# EAGLE design pomppurobotti (EAGLE 7.1.0)
dsdsdsds sddsdsdsds sddsds
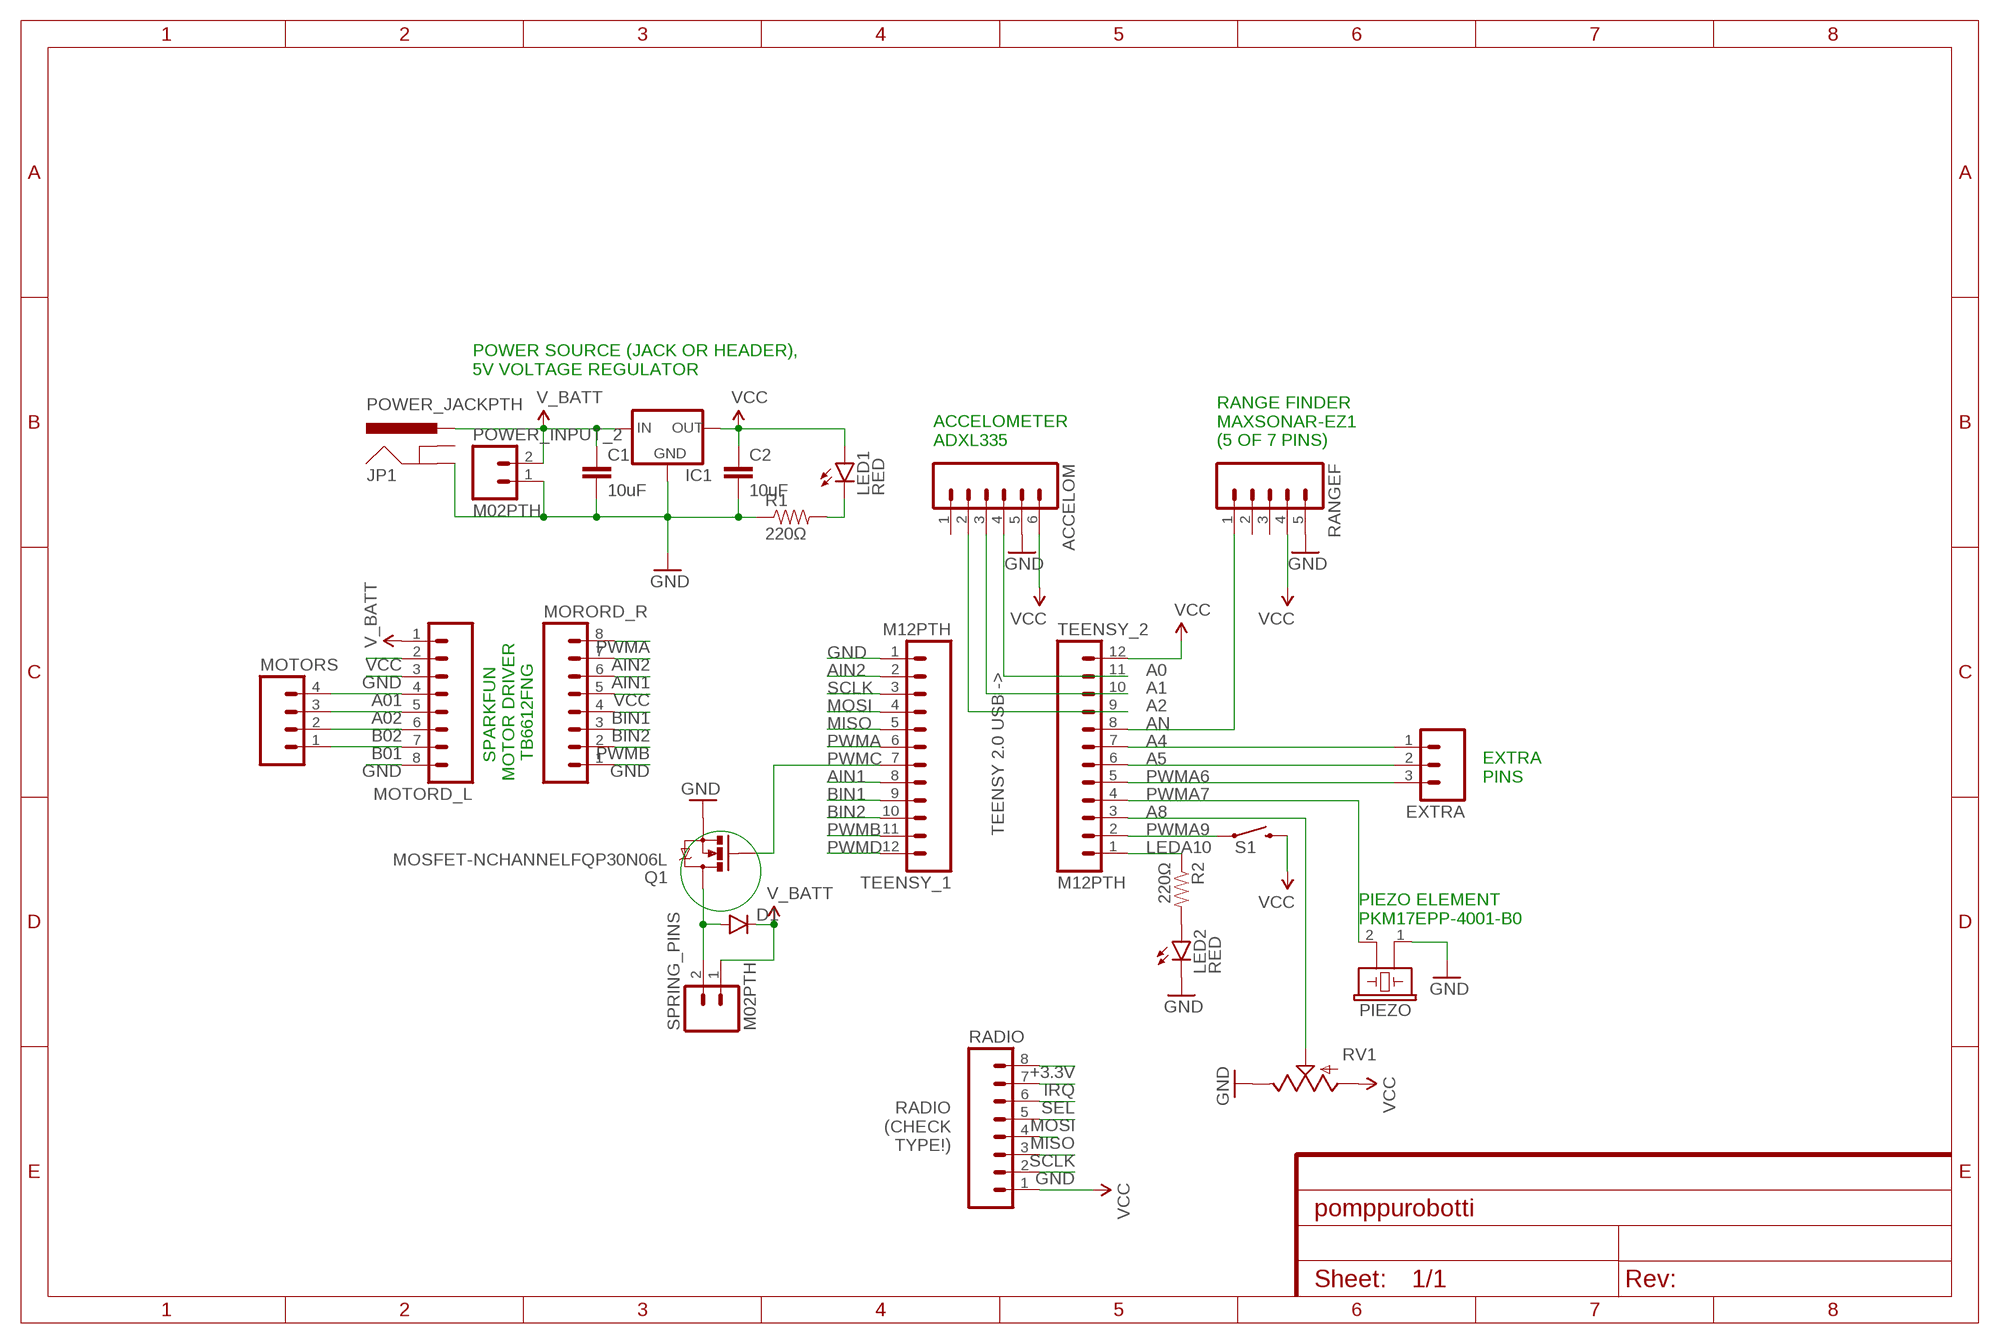
[diagram p0: schematic, sheet 1]
FRAME1 (FRAME-A4L): CNAME: Sähköpaja, pomppurobotin PCB; CREVISION: 23.11.14; DESIGNER: Atte Keinänen

## Parts
ACCELOM  M06SILK_FEMALE_PTH  [1X06]
C1  10uF  CAPPTH  [CAP-PTH-SMALL]
C2  10uF  CAPPTH  [CAP-PTH-SMALL]
D1  DIODEPTH  [DIODE-1N4001]
EXTRA  M03PTH  [1X03]
IC1  V_REG_78XX-TO-220  [TO-220-ALT]
JP1  POWER_JACKPTH  [POWER_JACK_PTH]
LED1  RED  LED5MM  [LED5MM]
LED2  RED  LED5MM  [LED5MM]
MORORD_R  M08LONGPADS  [1X08_LONGPADS]
MOTORD_L  M08LONGPADS  [1X08_LONGPADS]
MOTORS  M04PTH  [1X04]
PIEZO  EFBAA40D101  [EFBAA40D101]
POWER_INPUT_2  M02PTH  [1X02]
Q1  MOSFET-NCHANNELFQP30N06L  [TO220V]
R1  220Ω  RESISTORAXIAL-0.3  [AXIAL-0.3]
R2  220Ω  RESISTORAXIAL-0.3  [AXIAL-0.3]
RADIO  M08  [1X08_ROUND]
RANGEF  M05PTH  [1X05]
RV1  POTTRIM  [TRIM_POT]
S1  SWITCH-MOMENTARY-2PTH  [TACTILE-PTH]
SPRING_PINS  M02PTH  [1X02]
TEENSY_1  M12PTH  [1X12]
TEENSY_2  M12PTH  [1X12]

## Nets
+3.3V: RADIO.8
A0: ACCELOM.2 TEENSY_2.9
A1: ACCELOM.3 TEENSY_2.10
A01: MOTORD_L.4 MOTORS.4
A2: ACCELOM.4 TEENSY_2.11
A02: MOTORD_L.5 MOTORS.3
A4: EXTRA.1 TEENSY_2.7
A5: EXTRA.2 TEENSY_2.6
A8: RV1.1(S) TEENSY_2.3
AIN1: MORORD_R.6 TEENSY_1.8
AIN2: MORORD_R.7 TEENSY_1.2
AN: RANGEF.1 TEENSY_2.8
B01: MOTORD_L.7 MOTORS.1
B02: MOTORD_L.6 MOTORS.2
BIN1: MORORD_R.4 TEENSY_1.9
BIN2: MORORD_R.3 TEENSY_1.10
GND: ACCELOM.5 C1.2 C2.2 IC1.GND JP1.GND LED2.K(C) MORORD_R.1 MOTORD_L.3 MOTORD_L.8 PIEZO.1 POWER_INPUT_2.1 Q1.3(S) R1.P$1 RADIO.2 RANGEF.5 RV1.2(E) TEENSY_1.1
IRQ: RADIO.7
LEDA10: R2.P$1 TEENSY_2.1
MISO: RADIO.4 TEENSY_1.5
MOSI: RADIO.5 TEENSY_1.4
N$2: LED1.K(C) R1.P$2
N$4: LED2.A R2.P$2
N$5: D1.A Q1.2(D) SPRING_PINS.2
PWMA: MORORD_R.8 TEENSY_1.6
PWMA6: EXTRA.3 TEENSY_2.5
PWMA7: PIEZO.2 TEENSY_2.4
PWMA9: S1.1 TEENSY_2.2
PWMB: MORORD_R.2 TEENSY_1.11
PWMC: Q1.1(G) TEENSY_1.7
PWMD: TEENSY_1.12
SCLK: RADIO.3 TEENSY_1.3
SEL: RADIO.6
V_BATT: C1.1 D1.C IC1.IN JP1.PWR MOTORD_L.1 POWER_INPUT_2.2 SPRING_PINS.1
VCC: ACCELOM.6 C2.1 IC1.OUT LED1.A MORORD_R.5 MOTORD_L.2 RADIO.1 RANGEF.4 RV1.3(A) S1.3 TEENSY_2.12
Unconnected: ACCELOM.1 JP1.GNDBREAK RANGEF.2 RANGEF.3

## Notes on the sheet
- POWER SOURCE (JACK OR HEADER),
  5V VOLTAGE REGULATOR
- ACCELOMETER
  ADXL335
- RANGE FINDER
  MAXSONAR-EZ1
  (5 OF 7 PINS)
- SPARKFUN 
  MOTOR DRIVER
  TB6612FNG
- EXTRA
  PINS
- TEENSY 2.0 USB ->
- PIEZO ELEMENT
  PKM17EPP-4001-B0
- RADIO
  (CHECK
  TYPE!)

## Library data of the parts
ACCELOM = SparkFun-Connectors:M06: Header 6 Standard 6-pin 0.1" header. Use with straight break away headers (SKU : PRT-00116), right angle break away headers (PRT-00553), swiss pins (PRT-00743), machine pins (PRT-00117), and female headers (PRT-00115). Molex polarized connector foot print use with SKU : PRT-08094 with associated crimp pins and housings. NOTES ON THE VARIANTS LOCK and LOCK_LONGPADS... This footprint was designed to help hold the alignment of a through-hole component (i.e. 6-pin header) while soldering it into place. You may notice that each hole has been shifted either up or down by 0.005 of an inch from it's more standard position (which is a perfectly straight line). This slight alteration caused the pins (the squares in the middle) to touch the edges of the holes. Because they are alternating, it causes a "brace" to hold the component in place. 0.005 has proven to be the perfect amount of "off-center" position when using our standard breakaway headers. Although looks a little odd when you look at the bare footprint, once you have a header in there, the alteration is very hard to notice. Also,if you push a header all the way into place, it is covered up entirely on the bottom side. This idea of altering the position of holes to aid alignment will be further integrated into the Sparkfun Library for other footprints. It can help hold any component with 3 or more connection pins.; PROD_ID: CONN-08437
C1 C2 = SparkFun-Capacitors:CAP: Capacitor Standard 0603 ceramic capacitor, and 0.1" leaded capacitor.
D1 = SparkFun-DiscreteSemi:DIODE: Diode These are standard reverse protection diodes and small signal diodes. SMA package can handle up to about 1A. SOD-323 can handle about 200mA. What the SOD-323 package when ordering, there are some mfgs out there that are 5-pin packages.
EXTRA = SparkFun-Connectors:M03: Header 3 Standard 3-pin 0.1" header. Use with straight break away headers (SKU : PRT-00116), right angle break away headers (PRT-00553), swiss pins (PRT-00743), machine pins (PRT-00117), and female headers (PRT-00115). Molex polarized connector foot print use with SKU : PRT-08232 with associated crimp pins and housings.
IC1 = SparkFun-PowerIC:V_REG_78XX: Voltage Regulator Standard 7805 5V regulator. IGO (Input Ground Output). Spark Fun Electronics SKU : COM-00107
JP1 = SparkFun-Connectors:POWER_JACK: Power Jack This is the standard 5.5mm barrel jack for power. The PTH is the most common, proven, reliable, footprint. The Slot footprint only works if the mill layer is transmitted to the PCB fab house so be warned. Mating wall wart : TOL-00298 (and others); PROD_ID: CONN-08197
LED1 LED2 = SparkFun-LED:LED: LEDs Standard schematic elements and footprints for 5mm, 3mm, 1206, and 0603 sized LEDs. 5mm - Spark Fun Electronics SKU : COM-00529 (and others)
MORORD_R MOTORD_L RADIO = SparkFun-Connectors:M08: Header 8 Standard 8-pin 0.1" header. Use with straight break away headers (SKU : PRT-00116), right angle break away headers (PRT-00553), swiss pins (PRT-00743), machine pins (PRT-00117), and female headers (PRT-00115).
MOTORS = SparkFun-Connectors:M04: Header 4 Standard 4-pin 0.1" header. Use with straight break away headers (SKU : PRT-00116), right angle break away headers (PRT-00553), swiss pins (PRT-00743), machine pins (PRT-00117), and female headers (PRT-00115). Molex polarized connector foot print use with SKU : PRT-08231 with associated crimp pins and housings. 1MM SMD Version SKU: PRT-10208
PIEZO = buzzer:EFB?: Piezoelectric Acoustic Transducer Source: Panbasonic .. 2SC1685.pdf; OC_FARNELL: unknown; OC_NEWARK: unknown
POWER_INPUT_2 SPRING_PINS = SparkFun-Connectors:M02: Standard 2-pin 0.1" header. Use with - straight break away headers ( PRT-00116) - right angle break away headers (PRT-00553) - swiss pins (PRT-00743) - machine pins (PRT-00117) - female headers (PRT-00115) Molex polarized connector foot print use with: PRT-08233 with associated crimp pins and housings. 2.54_SCREWTERM for use with PRT-10571. 3.5mm Screw Terminal footprints for PRT-08084 5mm Screw Terminal footprints for use with PRT-08432
Q1 = SparkFun-DiscreteSemi:MOSFET-NCHANNEL: Common NMOSFET Parts MFG P/N Store ID Prod ID FDD8780 TRANS-09984 SI7820DN TRANS-11055 FDS6630A IC-08089 2N7002PW TRANS-11151 FQP30N06L COM-10213 TRANS-10060 BSS123LT1G TRANS-08345 BSS138 TRANS-00830 BS170 2N7000; PROD_ID: TRANS-10060
R1 R2 = SparkFun-Resistors:RESISTOR: Resistor Basic schematic elements and footprints for 0603, 1206, and PTH resistors.
RANGEF = SparkFun-Connectors:M05: Header 5 Standard 5-pin 0.1" header. Use with straight break away headers (SKU : PRT-00116), right angle break away headers (PRT-00553), swiss pins (PRT-00743), machine pins (PRT-00117), and female headers (PRT-00115). Molex polarized connector foot print use with SKU : PRT-08230 with associated crimp pins and housings.
RV1 = SparkFun-Electromechanical:POT
S1 = SparkFun-Electromechanical:SWITCH-MOMENTARY-2: Various NO switches- pushbuttons, reed, etc
TEENSY_1 TEENSY_2 = SparkFun-Connectors:M12: Header 12 Standard 12-pin 0.1" header. Use with straight break away headers (SKU : PRT-00116), right angle break away headers (PRT-00553), swiss pins (PRT-00743), machine pins (PRT-00117), and female headers (PRT-00115).

## Net classes
0 default: width 0.406 mm, clearance 0.406 mm

## Board
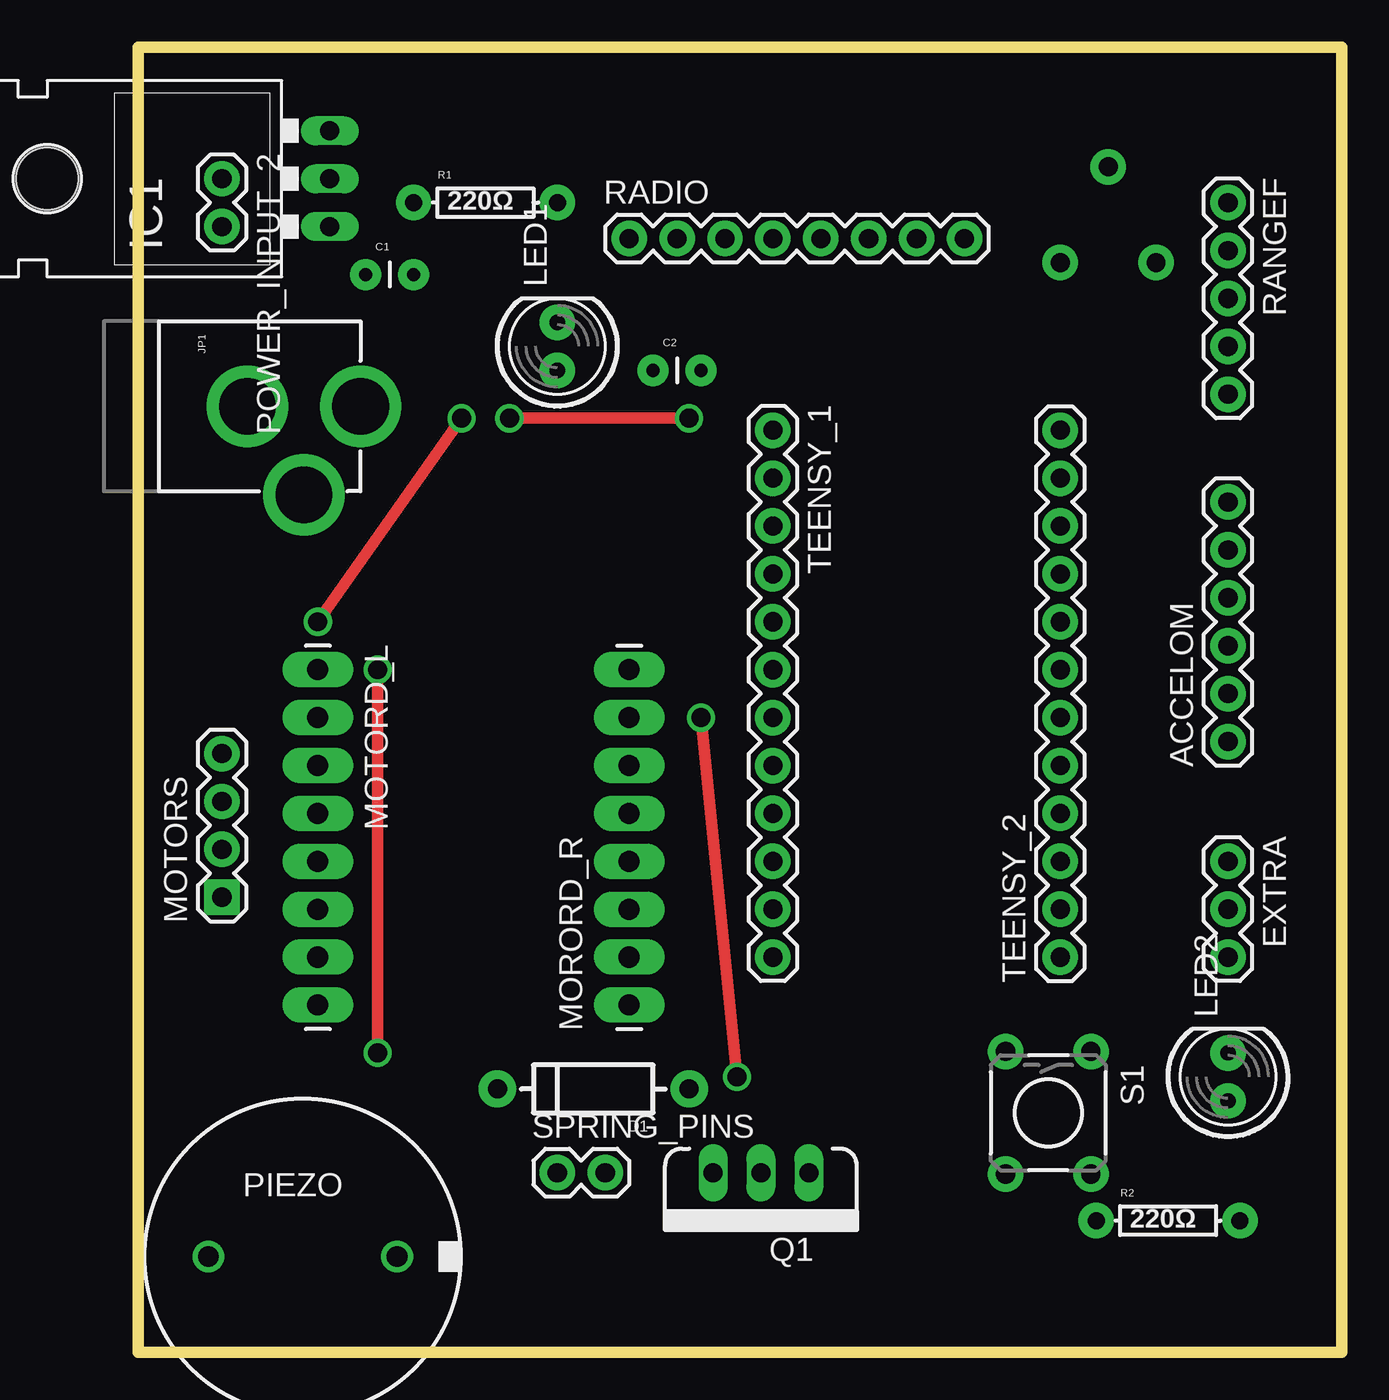
[diagram p1: board, top side]
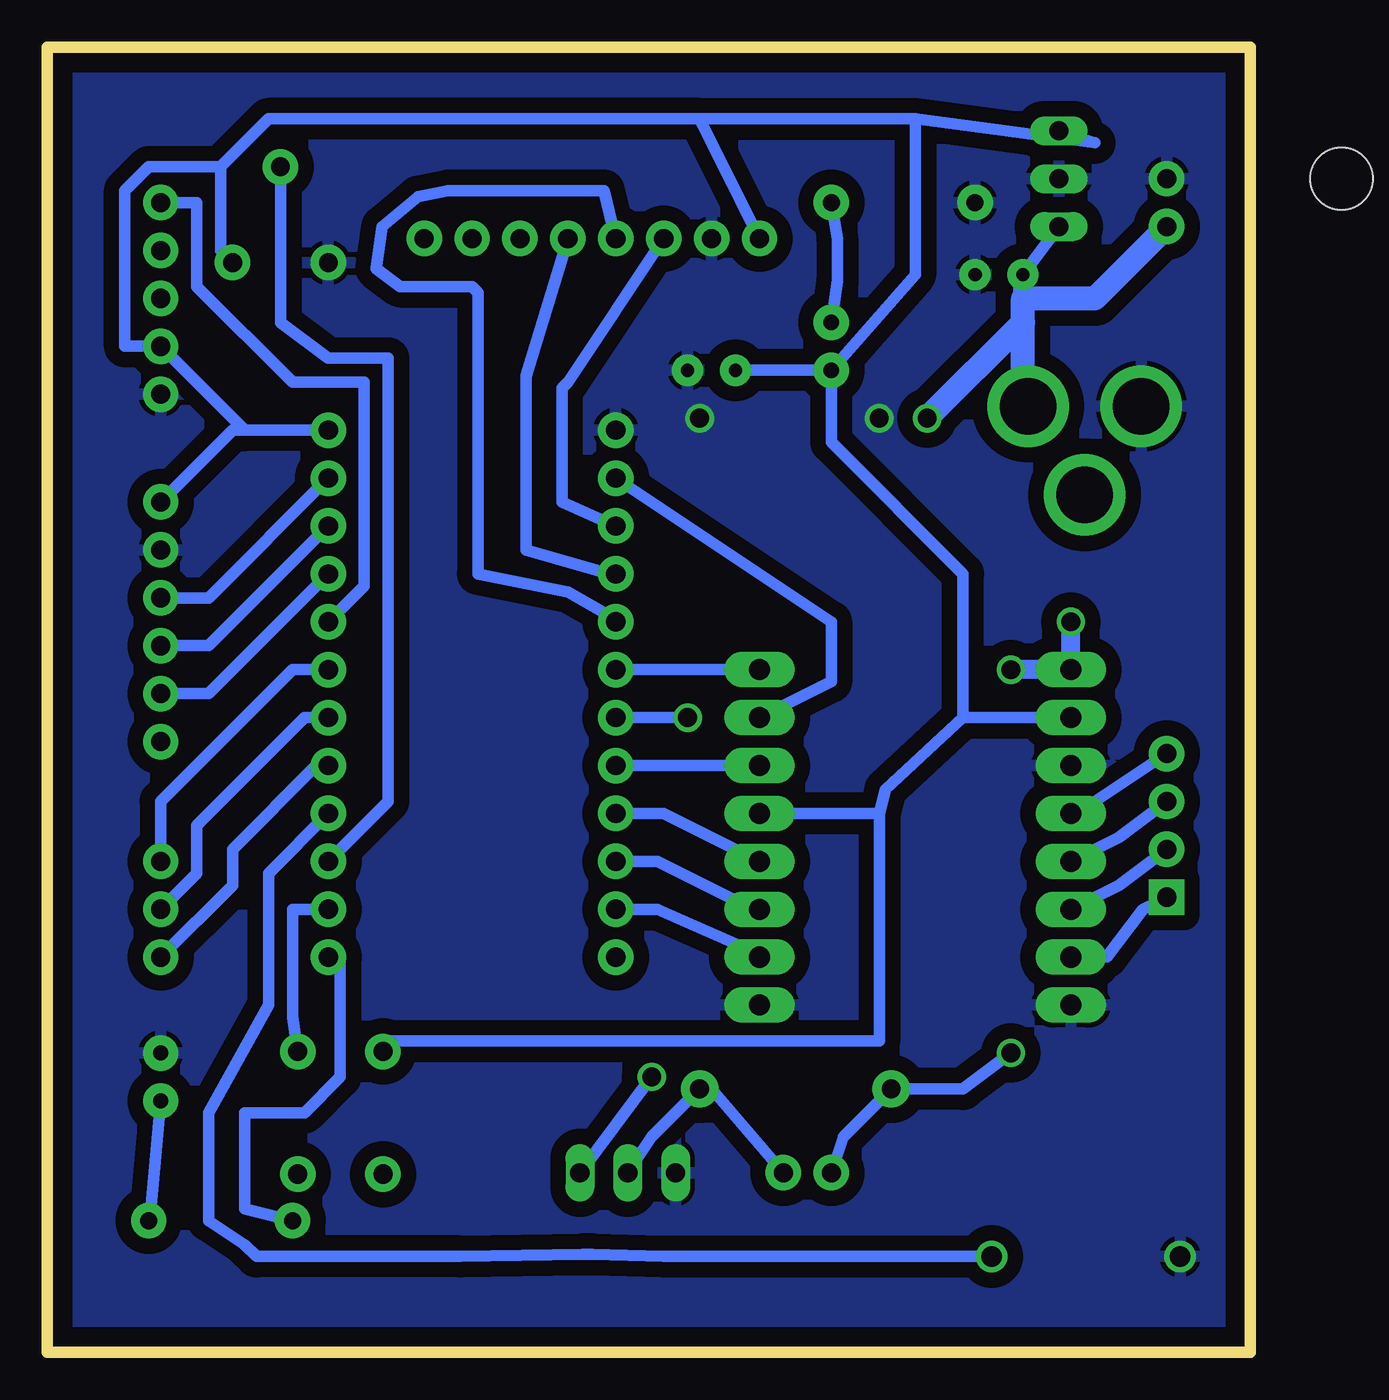
[diagram p2: board, bottom side, seen from below]

Size 63.8 x 69.2 mm. Coordinates in mm from the lower left corner, seen from the top.
Outline: 0,0 63.8,0 63.8,69.2 0,69.2 0,0
Copper layers (1*16): Top 0.035mm / dielectric 1.5mm / Bottom 0.035mm
Design rules "default *": minimum track width 24mil, minimum drill 24mil, track to track 24mil, track to pad 8mil, pad to pad 8mil, via to via 8mil, smd to smd 8mil, copper to edge 40mil, drill to drill 8mil, minimum pad ring 10mil, minimum via ring 8mil, stop-mask expansion 4mil, vias tented up to drill 0mil, thermal gap 10mil

### Footprints (pad centres in the part's own frame; a part is rotated, then mirrored left to right if it is on the bottom)
1X06 = drill 1.016 pad 1.88: 1 0,0; 2 2.54,0; 3 5.08,0; 4 7.62,0; 5 10.16,0; 6 12.7,0
CAP-PTH-SMALL = drill 0.7 pad 1.651: 1 0,0; 2 2.54,0
DIODE-1N4001 = drill 1 pad 1.981: A -5.08,0; C 5.08,0
1X03 = drill 1.016 pad 1.88: 1 0,0; 2 2.54,0; 3 5.08,0
TO-220-ALT = drill 1.016 long: GND 0,-3.81; IN -2.54,-3.81; OUT 2.54,-3.81 | hole 3.302: 0,11.176
POWER_JACK_PTH = drill 2.997 pad 4.318: GND 0,7.7; GNDBREAK 4.7,10.7; PWR 0,13.7
LED5MM = drill 0.813 pad 1.88: A -1.27,0; K 1.27,0
1X08_LONGPADS = drill 1.118 pad 1.88 long: 1 0,0; 2 2.54,0; 3 5.08,0; 4 7.62,0; 5 10.16,0; 6 12.7,0; 7 15.24,0; 8 17.78,0
1X04 = drill 1.016 pad 1.88 square: 1 0,0 | drill 1.016 pad 1.88: 2 2.54,0; 3 5.08,0; 4 7.62,0
EFBAA40D101 = drill 1.1 pad 1.676: 1 -5,0; 2 5,0
1X02 = drill 1.016 pad 1.88: 1 0,0; 2 2.54,0
TO220V = drill 1.016 long: 1 -2.54,0; 2 0,0; 3 2.54,0
AXIAL-0.3 = drill 0.9 pad 1.88: P$1 -3.81,0; P$2 3.81,0
1X08_ROUND = drill 1.016 pad 1.88: 1 0,0; 2 2.54,0; 3 5.08,0; 4 7.62,0; 5 10.16,0; 6 12.7,0; 7 15.24,0; 8 17.78,0
1X05 = drill 1.016 pad 1.88: 1 0,0; 2 2.54,0; 3 5.08,0; 4 7.62,0; 5 10.16,0
TRIM_POT = drill 1 pad 1.88: 1 5.08,0; 2 0,2.54; 3 0,-2.54
TACTILE-PTH = drill 1.016 pad 1.88: 1 -3.251,2.261; 2 3.251,2.261; 3 -3.251,-2.261; 4 3.251,-2.261
1X12 = drill 1.016 pad 1.88: 1 0,0; 2 2.54,0; 3 5.08,0; 4 7.62,0; 5 10.16,0; 6 12.7,0; 7 15.24,0; 8 17.78,0; 9 20.32,0; 10 22.86,0; 11 25.4,0; 12 27.94,0

### Placement (x,y rotation side)
ACCELOM  57.78,32.38 90 top
C1  12.06,57.15 0 top
C2  27.31,52.07 0 top
D1  24.13,13.97 180 top
EXTRA  57.78,26.03 270 top
IC1  6.35,62.23 90 top
JP1  -1.91,50.16 270 top
LED1  22.23,53.34 90 top
LED2  57.78,14.6 90 top
MORORD_R  26.04,18.41 90 top
MOTORD_L  9.53,36.2 270 top
MOTORS  4.45,24.13 90 top
PIEZO  8.73,5.08 0 top
POWER_INPUT_2  4.45,62.23 270 top
Q1  33.02,9.53 180 top
R1  18.42,60.96 0 top
R2  54.61,6.99 0 top
RADIO  26.04,59.05 0 top
RANGEF  57.78,60.96 270 top
RV1  51.43,57.78 90 top
S1  48.26,12.7 270 top
SPRING_PINS  22.23,9.53 0 top
TEENSY_1  33.66,48.89 270 top
TEENSY_2  48.89,20.95 90 top

### Tracks (layer width: path | path; a pad name or v marks a point on that pad's centre or on a via)
A0
  Bottom 0.61: TEENSY_2.9 55.24,34.92 ACCELOM.2
A1
  Bottom 0.61: TEENSY_2.10 55.24,37.46 ACCELOM.3
A01
  Bottom 0.61: MOTORS.4 8.26,29.21 MOTORD_L.4
A2
  Bottom 0.61: TEENSY_2.11 55.24,40 ACCELOM.4
A02
  Bottom 0.61: MOTORD_L.5 6.98,27.3 MOTORS.3
A4
  Bottom 0.61: 49.53,36.2 TEENSY_2.7 50.8,36.2 57.78,29.21 EXTRA.1
A5
  Bottom 0.61: TEENSY_2.6 50.16,33.66 55.88,27.94 55.88,25.4 EXTRA.2
A8
  Bottom 0.61: TEENSY_2.3 45.72,29.21 45.72,52.7 48.89,52.7 51.43,54.61 RV1.1
AIN1
  Bottom 0.61: TEENSY_1.8 MORORD_R.6
AIN2
  Bottom 0.61: MORORD_R.7 22.23,35.56 22.23,38.73 TEENSY_1.2
AN
  Bottom 0.61: TEENSY_2.8 46.99,40.64 46.99,51.43 50.8,51.43 55.88,56.52 55.88,60.96 RANGEF.1
B01
  Bottom 0.61: MOTORS.1 5.71,23.49 7.62,20.95 MOTORD_L.7
B02
  Bottom 0.61: MOTORD_L.6 6.98,24.77 MOTORS.2
BIN1
  Bottom 0.61: MORORD_R.4 31.12,28.57 TEENSY_1.9
BIN2
  Bottom 0.61: MORORD_R.3 26.35,23.49 31.43,26.03 TEENSY_1.10
GND  (via drill 1)
  Top 0.61: v19.69,49.53 v29.21,49.53
  pour Bottom (isolate 0.813): 0,69.22 62.86,69.22 62.86,0.63 0,0.63
LEDA10
  Bottom 0.61: R2.P$1 53.34,7.62 53.34,12.7 50.16,12.7 48.26,14.6 48.26,20.95 TEENSY_2.1
MISO
  Bottom 0.61: TEENSY_1.5 33.97,39.05 36.2,40.32 40.96,41.27 40.96,56.2 41.27,56.52 45.09,56.52 46.35,57.47 46.04,59.69 44.13,61.28 42.54,61.59 34.29,61.59 RADIO.4
MOSI
  Bottom 0.61: RADIO.5 38.42,51.75 38.42,42.55 33.97,41.27 TEENSY_1.4
N$2
  Bottom 0.61: LED1.K 21.91,56.83 21.91,59.05 R1.P$2
N$4
  Bottom 0.61: R2.P$2 58.42,6.35 LED2.A
N$5
  Bottom 0.61: SPRING_PINS.2 28.58,13.97 D1.A 31.75,11.43 Q1.2
PWMA
  Bottom 0.61: TEENSY_1.6 MORORD_R.8
PWMA6
  Bottom 0.61: TEENSY_2.5 49.53,31.11 53.98,26.67 53.98,24.77 EXTRA.3
PWMA7
  Bottom 0.61: PIEZO.2 31.12,5.08 34.92,5.21 35.38,5.21 41.91,5.08 52.7,5.08 53.34,5.72 55.24,6.99 55.24,12.7 52.07,18.41 52.07,25.4 TEENSY_2.4
PWMA9
  Bottom 0.61: TEENSY_2.2 50.8,23.49 50.8,17.78 S1.1
PWMB
  Bottom 0.61: MORORD_R.2 25.72,20.95 31.43,23.49 TEENSY_1.11
PWMC  (via drill 1)
  Top 0.61: v31.75,14.6 v29.85,33.66
  Bottom 0.61: TEENSY_1.7 v29.85,33.66 | Q1.1 v31.75,14.6
SCLK
  Bottom 0.61: RADIO.3 36.2,51.43 36.51,51.12 36.51,45.09 TEENSY_1.3
V_BATT  (via drill 1)
  Top 0.61: v12.7,15.88 v12.7,36.2 | v9.53,38.73 v17.15,49.53
  Bottom 0.61: C1.1 IC1.IN | 12.06,50.16 JP1.PWR | SPRING_PINS.1 21.59,11.43 D1.C 15.24,13.97 v12.7,15.88
  Bottom 1.016: v12.7,36.2 MOTORD_L.1 v9.53,38.73 | 12.06,55.88 C1.1 | 11.75,50.16 JP1.PWR
  Bottom 1.27: 12.06,50.16 12.06,54.61 | 12.06,54.61 12.06,55.88 8.26,55.88 POWER_INPUT_2.2 | 12.06,54.61 v17.15,49.53
VCC
  Bottom 0.61: 19.69,28.57 19.37,29.84 15.24,33.66 | 19.69,28.57 MORORD_R.5 | 29.21,65.41 17.78,65.41 | 17.78,65.41 8.26,64.14 IC1.OUT | RADIO.1 29.21,65.41 | 29.21,65.41 52.07,65.41 54.61,62.86 | LED1.A 17.78,57.15 17.78,65.41 | 19.69,28.57 19.69,16.51 45.72,16.51 S1.3 | LED1.A C2.1 | 15.24,33.66 MOTORD_L.2 | 15.24,33.66 15.24,41.27 22.23,48.26 LED1.A | ACCELOM.6 53.98,48.89 53.34,48.89 | TEENSY_2.12 53.34,48.89 | 53.34,48.89 RANGEF.4 59.69,53.34 59.69,61.59 58.42,62.86 54.61,62.86 | 54.61,62.86 54.61,58.42 RV1.3